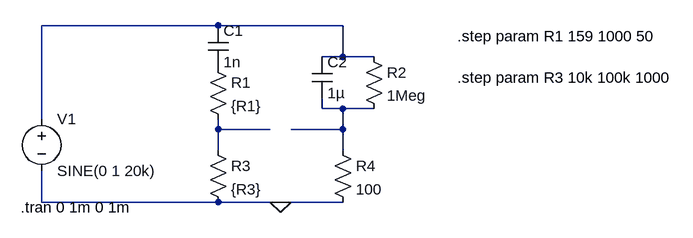
[diagram p0: schematic simulacion.asc]
simulacion.asc, the LTspice schematic file:
Version 4
SHEET 1 952 680
WIRE 224 16 -48 16
WIRE 416 16 224 16
WIRE 416 64 416 16
WIRE 416 64 384 64
WIRE 464 64 416 64
WIRE 384 144 384 128
WIRE 416 144 384 144
WIRE 464 144 416 144
WIRE -48 160 -48 16
WIRE 224 176 224 160
WIRE 304 176 224 176
WIRE 416 176 416 144
WIRE 416 176 336 176
WIRE 224 208 224 176
WIRE 416 208 416 176
WIRE -48 288 -48 240
WIRE 224 288 -48 288
WIRE 320 288 224 288
WIRE 416 288 320 288
FLAG 320 288 0
SYMBOL voltage -48 144 R0
WINDOW 123 0 0 Left 0
WINDOW 39 0 0 Left 0
SYMATTR InstName V1
SYMATTR Value SINE(0 1 20k)
SYMBOL cap 208 16 R0
SYMATTR InstName C1
SYMATTR Value 1n
SYMBOL res 208 64 R0
SYMATTR InstName R1
SYMATTR Value {R1}
SYMBOL res 208 192 R0
SYMATTR InstName R3
SYMATTR Value {R3}
SYMBOL res 400 192 R0
SYMATTR InstName R4
SYMATTR Value 100
SYMBOL cap 368 64 R0
SYMATTR InstName C2
SYMATTR Value 1µ
SYMBOL res 448 48 R0
SYMATTR InstName R2
SYMATTR Value 1Meg
TEXT 592 32 Left 2 !.step param R1 159 1000 50
TEXT 592 96 Left 2 !.step param R3 10k 100k 1000
TEXT -80 296 Left 2 !.tran 0 1m 0 1m

The netlist it stands for:
* simulacion.asc
V1 N001 0 SINE(0 1 20k)
C1 N001 P001 1n
R1 P001 N003 {R1}
R3 N003 0 {R3}
R4 N002 0 100
C2 N001 N002 1µ
R2 N001 N002 1Meg
.step param R1 159 1000 50
.step param R3 10k 100k 1000
.tran 0 1m 0 1m
.backanno
.end